# Altium schematic sheet [01] - Sheet Connection.SchDoc: =ProjectName
size A4; CheckedBy: Ven; Author: Ven; CompanyName: HUST; Revision: V.1.0
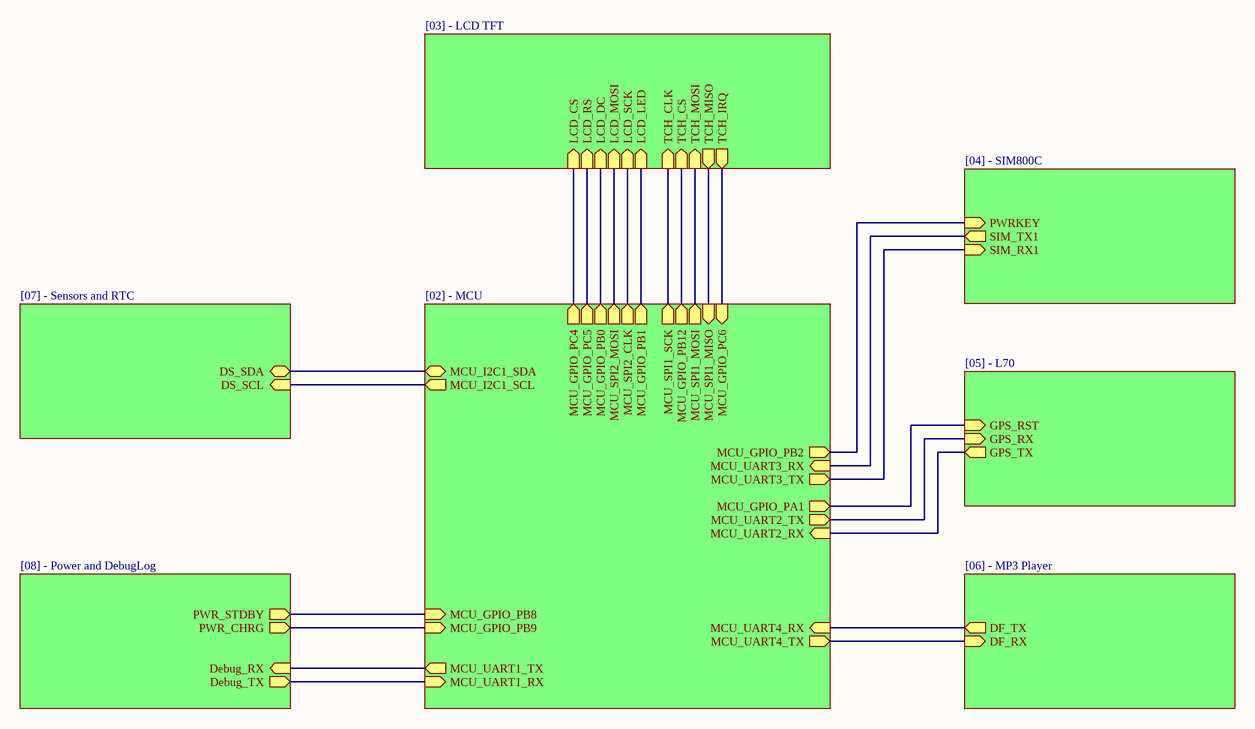
[diagram p0: [01] - Sheet Connection.SchDoc]

## Sub-sheets
01 = [02] - MCU: MCU_UART2_RX (in), MCU_SPI1_SCK (out), MCU_UART1_RX (in), MCU_UART3_TX (out), MCU_SPI2_CLK (out), MCU_I2C1_SDA (bidir), MCU_UART3_RX (in), MCU_GPIO_PB0 (out), MCU_GPIO_PB1 (out), MCU_UART1_TX (out), MCU_GPIO_PC5 (out), MCU_SPI1_MOSI (out), MCU_UART2_TX (out), MCU_GPIO_PC4 (out), MCU_GPIO_PB2 (out), MCU_I2C1_SCL (out), MCU_SPI2_MOSI (out), MCU_SPI1_MISO (in), MCU_UART4_TX (out), MCU_UART4_RX (in), MCU_GPIO_PA1 (out), MCU_GPIO_PB12 (out), MCU_GPIO_PC6 (in), MCU_GPIO_PB8 (in), MCU_GPIO_PB9 (in)
02 = [03] - LCD TFT: LCD_LED (in), TCH_CS (in), LCD_CS (in), TCH_IRQ (out), TCH_MISO (out), LCD_SCK (in), LCD_RS (in), TCH_CLK (in), LCD_DC (in), LCD_MOSI (in), TCH_MOSI (in)
03 = [04] - SIM800C: SIM_TX1 (out), PWRKEY (in), SIM_RX1 (in)
04 = [05] - L70: GPS_RST (in), GPS_RX (in), GPS_TX (out)
05 = [06] - MP3 Player: DF_TX (out), DF_RX (in)
06 = [07] - Sensors and RTC: DS_SDA (bidir), DS_SCL (in)
07 = [08] - Power and DebugLog: Debug_RX (in), Debug_TX (out), PWR_STDBY (out), PWR_CHRG (out)

## Nets
(unnamed): sheet 01/MCU_UART2_RX, sheet 04/GPS_TX
(unnamed): sheet 01/MCU_SPI1_SCK, sheet 02/TCH_CLK
(unnamed): sheet 01/MCU_UART1_RX, sheet 07/Debug_TX
(unnamed): sheet 01/MCU_UART3_TX, sheet 03/SIM_RX1
(unnamed): sheet 01/MCU_SPI2_CLK, sheet 02/LCD_SCK
(unnamed): sheet 01/MCU_I2C1_SDA, sheet 06/DS_SDA
(unnamed): sheet 01/MCU_UART3_RX, sheet 03/SIM_TX1
(unnamed): sheet 01/MCU_GPIO_PB0, sheet 02/LCD_DC
(unnamed): sheet 01/MCU_GPIO_PB1, sheet 02/LCD_LED
(unnamed): sheet 01/MCU_UART1_TX, sheet 07/Debug_RX
(unnamed): sheet 01/MCU_GPIO_PC5, sheet 02/LCD_RS
(unnamed): sheet 01/MCU_SPI1_MOSI, sheet 02/TCH_MOSI
(unnamed): sheet 01/MCU_UART2_TX, sheet 04/GPS_RX
(unnamed): sheet 01/MCU_GPIO_PC4, sheet 02/LCD_CS
(unnamed): sheet 01/MCU_GPIO_PB2, sheet 03/PWRKEY
(unnamed): sheet 01/MCU_I2C1_SCL, sheet 06/DS_SCL
(unnamed): sheet 01/MCU_SPI2_MOSI, sheet 02/LCD_MOSI
(unnamed): sheet 01/MCU_SPI1_MISO, sheet 02/TCH_MISO
(unnamed): sheet 01/MCU_UART4_TX, sheet 05/DF_RX
(unnamed): sheet 01/MCU_UART4_RX, sheet 05/DF_TX
(unnamed): sheet 01/MCU_GPIO_PA1, sheet 04/GPS_RST
(unnamed): sheet 01/MCU_GPIO_PB12, sheet 02/TCH_CS
(unnamed): sheet 01/MCU_GPIO_PC6, sheet 02/TCH_IRQ
(unnamed): sheet 01/MCU_GPIO_PB8, sheet 07/PWR_STDBY
(unnamed): sheet 01/MCU_GPIO_PB9, sheet 07/PWR_CHRG

## Notes on the sheet
- Project:
- Page Contents:
- Size:
- Date:
- A4
- Checked by:
- Time:
- Revision:
- Sheet
- of
- File: